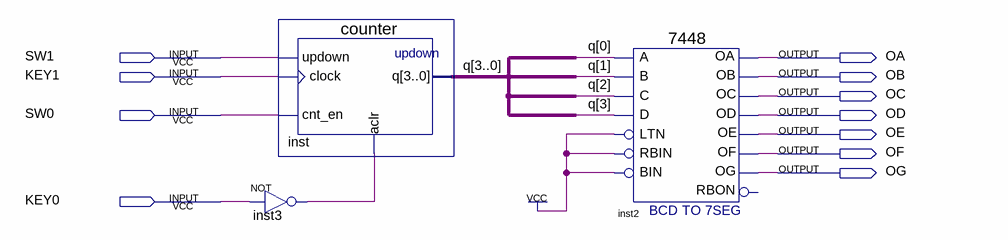
[diagram p0: schematic sheet]
// Quartus schematic main.bdf as structural Verilog: 3 symbols, 11 pins
module main (
  input  SW1,
  input  KEY1,
  input  SW0,
  input  KEY0,
  output OA,
  output OB,
  output OC,
  output OD,
  output OE,
  output OF,
  output OG
);

  wire inst3_out;
  wire [3:0] q;

  not inst3 (inst3_out, KEY0);
  counter inst (.updown(SW1), .clock(KEY1), .cnt_en(SW0), .aclr(inst3_out), .q(q));
  \7448  inst2 (
    .A(q[0]), .C(q[2]), .D(q[3]), .B(q[1]), .RBIN(1'b1), .BIN(1'b1), .LTN(1'b1), .OC(OC), .OE(OE), .OD(OD),
    .OF(OF), .OG(OG), .OB(OB), .OA(OA));  // open: RBON
endmodule
